# EAGLE schematic ctrlr_w_MCP4912 (EAGLE 8.7.1)
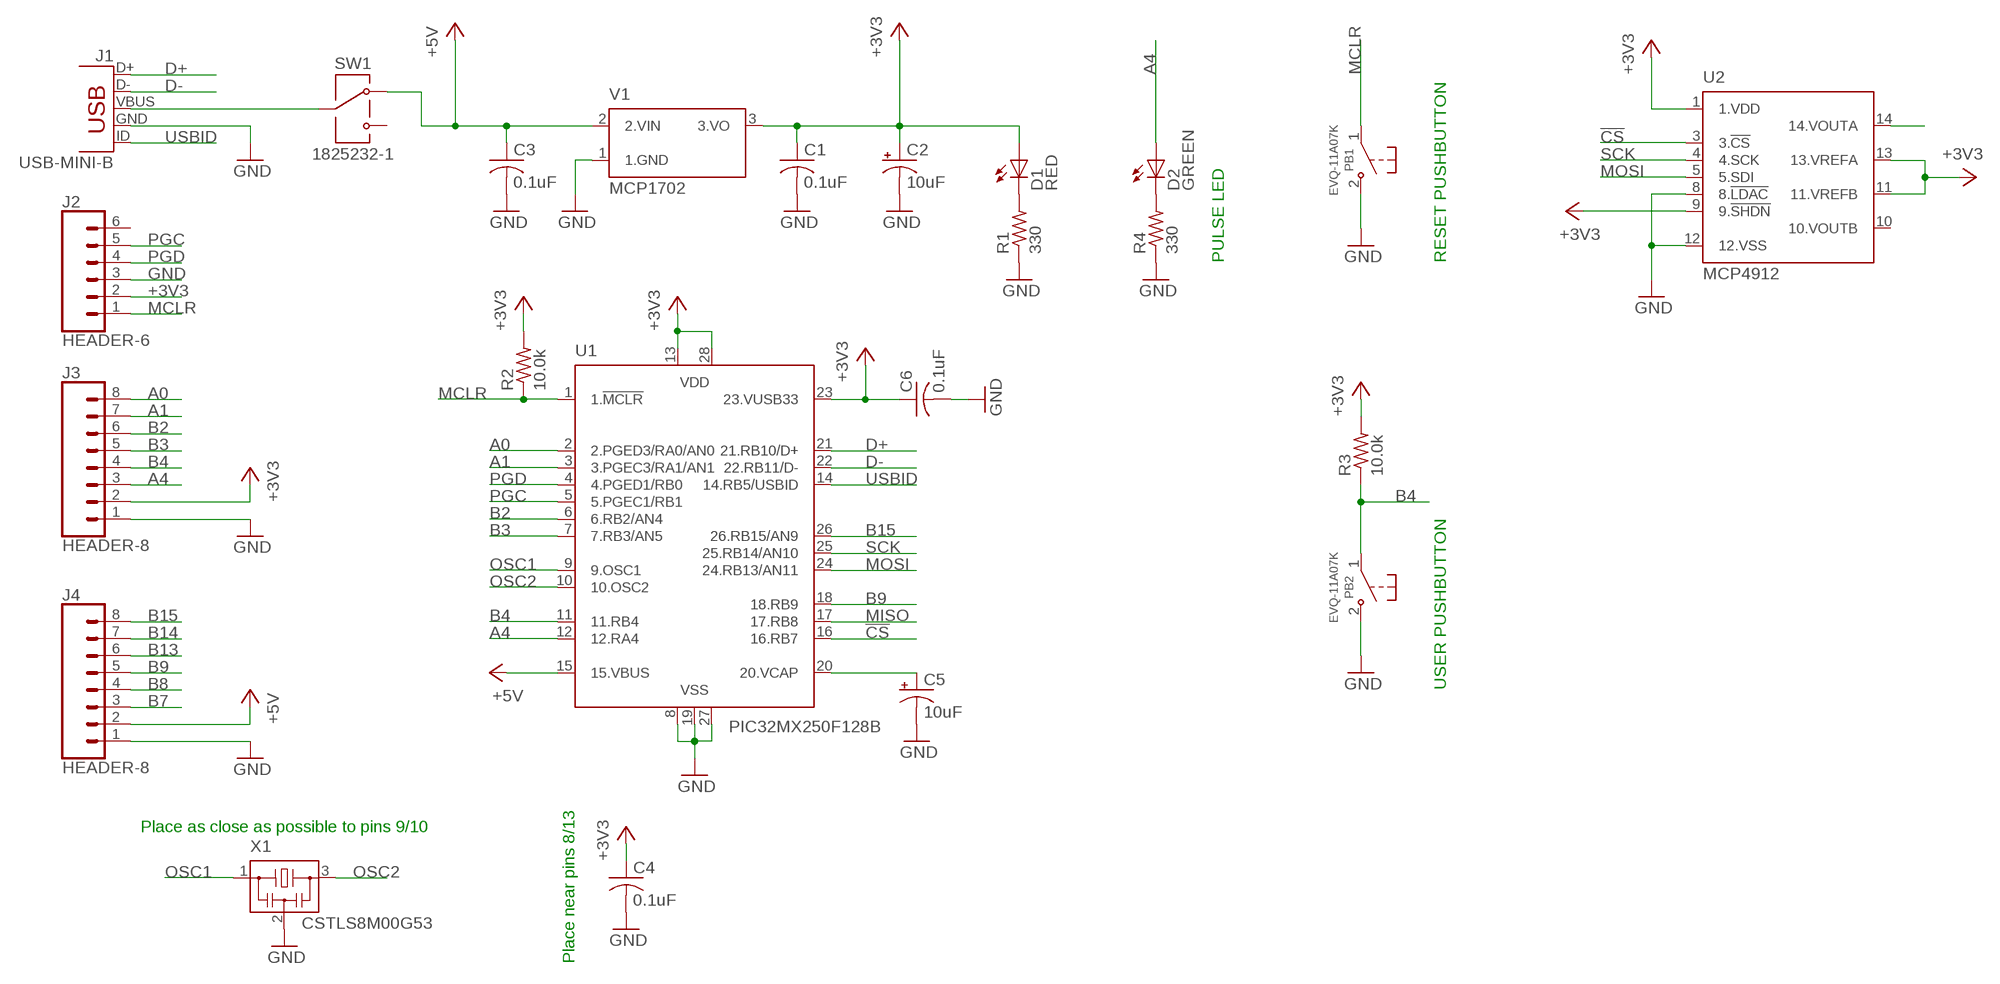
[diagram p0: schematic, sheet 1]

## Parts
C1  0.1uF  C-USC1206  [C1206]
C2  10uF  CPOL-USTAP5-50  [TAP5-50]
C3  0.1uF  C-USC1206  [C1206]
C4  0.1uF  C-USC1206  [C1206]
C5  10uF  CPOL-USTAP5-50  [TAP5-50]
C6  0.1uF  C-USC1206  [C1206]
D1  LED-RED  [LED-3MM-V]
D2  LED-GREEN  [LED-3MM-V]
J1  USB-MINI-B  [USB-MB-TO]
J2  HEADER-6  [CONN_1X06]
J3  HEADER-8  [CONN_1X08]
J4  HEADER-8  [CONN_1X08]
PB1  EVQ-11A07K  [PCPIN-2]
PB2  EVQ-11A07K  [PCPIN-2]
R1  330  R-US_R1206  [R1206]
R2  10.0k  R-US_R1206  [R1206]
R3  10.0k  R-US_R1206  [R1206]
R4  330  R-US_R1206  [R1206]
SW1  1825232-1  [PCPIN-3SS]
U1  PIC32MX250F128B  [DIP28-3]
U2  MCP4912  [DIP14-3]
V1  MCP1702  [TO-92]
X1  CSTLS8M00G53  [RAD-3-2.5]

## Nets
!CS!: U1.16(16.RB7) U2.3(3.!CS!)
+3V3: C1.1 C2.+ C4.1 C6.1 D1.A J2.2(2.) J3.2(2.) R2.2 R3.2 U1.13(13.VDD) U1.23(23.VUSB33) U1.28(28.AVDD) U2.1(1.VDD) U2.9(9.!SHDN!) U2.11(11.VREFB) U2.13(13.VREFA) V1.3(3.VO)
+5V: C3.1 J4.2(2.) SW1.1 U1.15(15.VBUS) V1.2(2.VIN)
A0: J3.8(8.) U1.2(2.PGED3/RA0/AN0)
A1: J3.7(7.) U1.3(3.PGEC3/RA1/AN1)
A4: D2.A J3.3(3.) U1.12(12.RA4)
B2: J3.6(6.) U1.6(6.RB2/AN4)
B3: J3.5(5.) U1.7(7.RB3/AN5)
B4: J3.4(4.) PB2.1(1.A) R3.1 U1.11(11.RB4)
B7: J4.3(3.)
B8: J4.4(4.)
B9: J4.5(5.) U1.18(18.RB9)
B13: J4.6(6.)
B14: J4.7(7.)
B15: J4.8(8.) U1.26(26.RB15/AN9)
D+: J1.D+ U1.21(21.RB10/D+)
D-: J1.D- U1.22(22.RB11/D-)
GND: C1.2 C2.- C3.2 C4.2 C5.- C6.2 J1.GND J2.3(3.) J3.1(1.) J4.1(1.) PB1.2(2.B) PB2.2(2.B) R1.1 R4.1 U1.8(8.VSS) U1.19(19.VSS) U1.27(27.AVSS) U2.8(8.!LDAC!) U2.12(12.VSS) V1.1(1.GND) X1.2
MCLR: J2.1(1.) PB1.1(1.A) R2.1 U1.1(1.!MCLR)
MISO: U1.17(17.RB8)
MOSI: U1.24(24.RB13/AN11) U2.5(5.SDI)
N$1: D2.K(C) R4.2
N$4: D1.K(C) R1.2
N$5: J1.VBUS SW1.2
N$6: C5.+ U1.20(20.VCAP)
N$8: U2.14(14.VOUTA)
OSC1: U1.9(9.OSC1) X1.1
OSC2: U1.10(10.OSC2) X1.3
PGC: J2.5(5.) U1.5(5.PGEC1/RB1)
PGD: J2.4(4.) U1.4(4.PGED1/RB0)
SCK: U1.25(25.RB14/AN10) U2.4(4.SCK)
USBID: J1.ID U1.14(14.RB5/USBID)
Unconnected: J2.6(6.) SW1.3 U2.10(10.VOUTB)

## Notes on the sheet
- PULSE LED | RESET PUSHBUTTON
- USER PUSHBUTTON
- Place as close as possible to pins 9/10
- Place near pins 8/13

## Library data of the parts
C1 C3 C4 C6 = rcl:C-US: CAPACITOR, American symbol; SPICEPREFIX: C
C2 C5 = rcl:CPOL-US: POLARIZED CAPACITOR, American symbol; SPICEPREFIX: C
D1 = me433:LED-RED: LED, 3mm, RED * Pin Count : 2 * LED Diameter : 3mm * Color : RED; COLOR: RED
D2 = me433:LED-GREEN: LED, 3mm, GREEN * Pin Count : 2 * LED Diameter : 3mm * Color : GREEN; COLOR: GREEN
J1 = me433:USB-MINI-B: USB Mini - B-type * Pin Count : 5 * Note Restricted areas for placement
J2 = me433:HEADER-6: 6-Pin Header Generic 6-pin header connector
J3 J4 = me433:HEADER-8: 8-Pin Header Generic 8-pin header connector
PB1 PB2 = me433:EVQ-11A07K: Pushbutton Switch - SPST Generic SPST pushbutton switch symbol, Normally Open (NO), 2-pin
R1-R4 = rcl:R-US_: RESISTOR, American symbol; SPICEPREFIX: R
SW1 = me433:1825232-1: Slide Switch - SPDT Generic SPDT slide switch symbol, 3-pin
U1 = me433:PIC32MX250F128B: PIC32MX250F128B Microchip Technology * 28-pin DIP package * 32-bit Microcontroller * 19 remappable pins * 128 kB of Program Memory * 32 kB of Data Memory * 2 UART, 2 SPI interfaces
U2 = me433:MCP4912: MCP4912 - D/A Converter Microchip Technology * 10-bit Dual Voltage Analog Output * 2.7 - 5.5 V Single Supply Operation * SPI Interface
V1 = me433:MCP1702: MCP1702 - Linear Regulator Microchip Technology * Output : 250mA @ 3.3V * Input : Up to 13.2 V * Package : TO-92-3
X1 = me433:CSTLS8M00G53: 8Mhz Crystal Oscillator Murata Electronics * Pin Count : 3 * Frequency : 8 MHz * Package : Through-Hole